# Altium project Super_Iron.PrjPcb
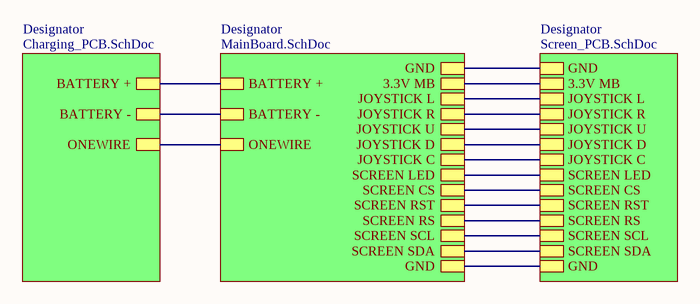
[diagram p0: main.SchDoc]
4 sheets, 165 parts. Net scope: hierarchical (ports join the sheet entries above them; power ports are global).
Sheets:
  main.SchDoc
    Designator = Charging_PCB.SchDoc
    Designator = MainBoard.SchDoc
    Designator = Screen_PCB.SchDoc

## Sheet main.SchDoc
size A2; Organization: Altium Limited; Address1: L3, 12a Rodborough Rd; Address2: Frenchs Forest; Address3: NSW; Address4: Australia 2086

### Sub-sheets
Designator = Charging_PCB.SchDoc: BATTERY +, BATTERY -, ONEWIRE
Designator = MainBoard.SchDoc: BATTERY +, BATTERY -, ONEWIRE, GND, 3.3V MB, SCREEN CS, JOYSTICK D, SCREEN SCL, JOYSTICK U, SCREEN SDA, SCREEN RS, JOYSTICK R, JOYSTICK L, JOYSTICK C, SCREEN RST, SCREEN LED, GND
Designator = Screen_PCB.SchDoc: SCREEN LED, GND, GND, SCREEN SDA, JOYSTICK C, SCREEN CS, SCREEN SCL, JOYSTICK U, SCREEN RS, 3.3V MB, SCREEN RST, JOYSTICK R, JOYSTICK D, JOYSTICK L

### Nets
GND: sheet Designator/BATTERY -, sheet Designator/BATTERY -, sheet Designator/GND, sheet Designator/GND, sheet Designator/GND, sheet Designator/GND
3.3V MB: sheet Designator/3.3V MB, sheet Designator/3.3V MB
BATTERY +: sheet Designator/BATTERY +, sheet Designator/BATTERY +
JOYSTICK D: sheet Designator/JOYSTICK D, sheet Designator/JOYSTICK D
JOYSTICK L: sheet Designator/JOYSTICK L, sheet Designator/JOYSTICK L
JOYSTICK R: sheet Designator/JOYSTICK R, sheet Designator/JOYSTICK R
JOYSTICK U: sheet Designator/JOYSTICK U, sheet Designator/JOYSTICK U
JOYSTICK С: sheet Designator/JOYSTICK C, sheet Designator/JOYSTICK C
ONEWIRE: sheet Designator/ONEWIRE, sheet Designator/ONEWIRE
SCREEN CS: sheet Designator/SCREEN CS, sheet Designator/SCREEN CS
SCREEN RS: sheet Designator/SCREEN RS, sheet Designator/SCREEN RS
SCREEN RST: sheet Designator/SCREEN RST, sheet Designator/SCREEN RST
SCREEN SCL: sheet Designator/SCREEN SCL, sheet Designator/SCREEN SCL
SCREEN SDA: sheet Designator/SCREEN SDA, sheet Designator/SCREEN SDA
NetR28_2: sheet Designator/SCREEN LED, sheet Designator/SCREEN LED

### Notes on the sheet
- Title
- Size:
- Date:
- File:
- A2
- Number:
- Time:
- Revision:
- Sheet
- of

## Sheet Charging_PCB.SchDoc
size A2; Organization: Altium Limited; Address1: L3, 12a Rodborough Rd; Address2: Frenchs Forest; Address3: NSW; Address4: Australia 2086
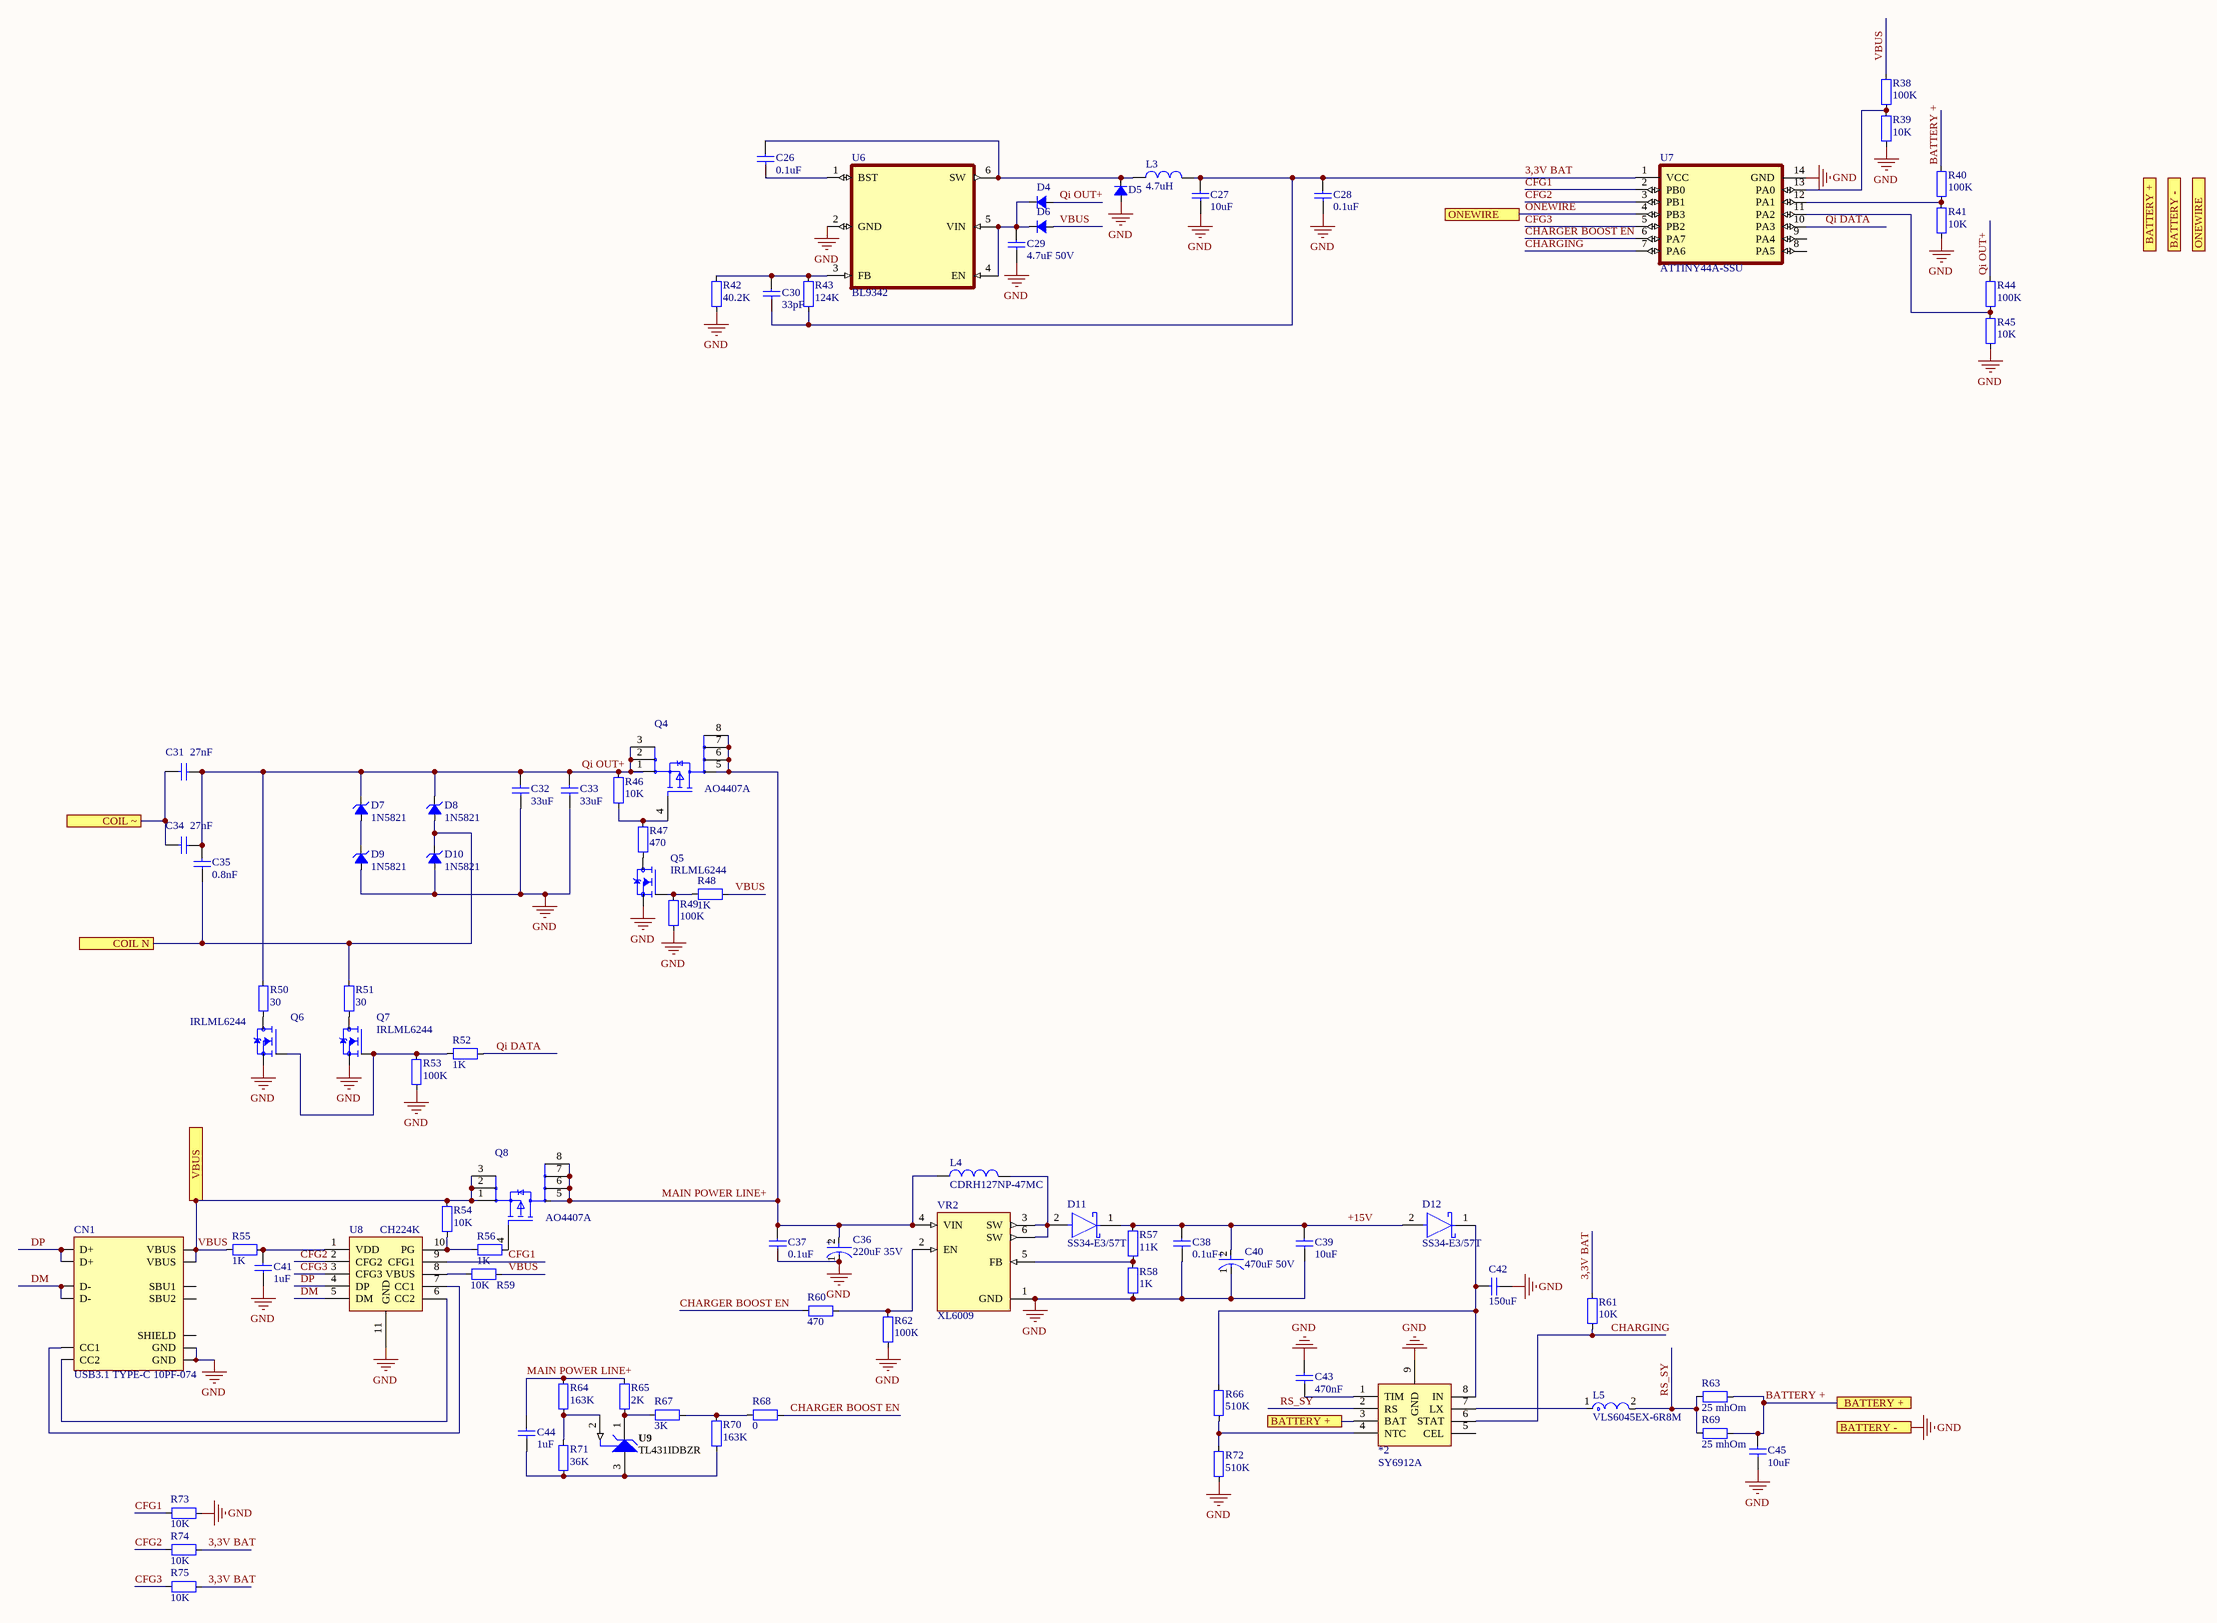
[diagram p1: Charging_PCB.SchDoc]

### Parts
*2  SY6912A  [SO8]
C26  0.1uF  [C0805]
C27  10uF  [C0805]
C28  0.1uF  [C0805]
C29  4.7uF 50V  [C0805]
C30  33pF  [C0805]
C31  27nF  [1206]
C32  33uF  [1206]
C33  33uF  [1206]
C34  27nF  [1206]
C35  0.8nF  [1206]
C36  220uF 35V  [FP-RAD-TH-D_8_0_5-L_15_1-MFG]
C37  0.1uF  [1206]
C38  0.1uF  [1206]
C39  10uF  [CAPC1005X04L]
C40  470uF 50V  [FP-RAD-TH-D_10_0_5-L_20_2-MFG]
C41  1uF  [1206]
C42  150uF  [CAPC1005X04L]
C43  470nF  [C0805]
C44  1uF  [1206]
C45  10uF  [CAPC1005X04L]
CN1  USB3.1 TYPE-C 10PF-074  [USB3.1 TYPE-C 10PF-074]
D4  (no value)  [SOD-123]
D5  (no value)  [SOD-123]
D6  (no value)  [SOD-123]
D7  1N5821  [DO201-vertical]
D8  1N5821  [DO201-vertical]
D9  1N5821  [DO201-vertical]
D10  1N5821  [DO201-vertical]
D11  SS34-E3/57T  [FP-95402-MFG]
D12  SS34-E3/57T  [FP-95402-MFG]
L3  4.7uH  [CDRH3D16NP]
L4  CDRH127NP-47MC  [SUMI-CDRH127_V]
L5  VLS6045EX-6R8M  [FP-VLS6045EX-100M-MFG]
Q4  AO4407A  [SOP-8_2-5R1S-IPC_B]
Q5  IRLML6244  [SOT-23]
Q6  IRLML6244  [SOT-23]
Q7  IRLML6244  [SOT-23]
Q8  AO4407A  [SOP-8_2-5R1S-IPC_B]
R38  100K  [C0805]
R39  10K  [C0805]
R40  100K  [C0805]
R41  10K  [C0805]
R42  40.2K  [C0805]
R43  124K  [C0805]
R44  100K  [C0805]
R45  10K  [C0805]
R46  10K  [C0805]
R47  470  [C0805]
R48  1K  [C0805]
R49  100K  [C0805]
R50  30  [1206]
R51  30  [1206]
R52  1K  [C0805]
R53  100K  [C0805]
R54  10K  [C0805]
R55  1K  [C0805]
R56  1K  [C0805]
R57  11K  [C0805]
R58  1K  [C0805]
R59  10K  [C0805]
R60  470  [C0805]
R61  10K  [C0805]
R62  100К  [C0805]
R63  25 mhOm  [1206]
R64  163K  [C0805]
R65  2K  [C0805]
R66  510K  [C0805]
R67  3K  [C0805]
R68  0  [C0805]
R69  25 mhOm  [1206]
R70  163K  [C0805]
R71  36K  [C0805]
R72  510K  [C0805]
R73  10K  [C0805]
R74  10K  [C0805]
R75  10K  [C0805]
U6  BL9342  [SOT50P160X60-6N]
U7  ATTINY44A-SSU  [SOIC127P600X175-14N]
U8  CH224K  [ESSOP10]
U9  TL431IDBZR  [SOT95P237X112-3N]
VR2  XL6009  [DPAK170P1435X465-6N]

### Ports
BATTERY +, BATTERY -, COIL N, COIL ~, ONEWIRE, VBUS

### Nets
GND: *2.9(GND) C27.1 C28.1 C29.1 C32.2 C33.2 C36.1(C) C37.1 C38.1 C39.1 C40.1(C) C41.1 C42.2 C43.2 C45.1 CN1.1(GND) CN1.12(GND) D5.1(A) D9.1(K) D10.1(K) Q5.2(S) Q6.2(S) Q7.2(S) R39.1 R41.1 R42.1 R45.1 R49.1 R53.1 R58.2 R62.2 R72.2 R73.2 U6.2(GND) U7.14(GND) U8.11(GND) VR2.1(GND) ; port BATTERY -
3,3V BAT: C27.2 C28.2 C30.1 L3.2 R43.1 R61.2 R74.2 R75.2 U7.1(VCC)
+15V: C38.2 C39.2 C40.2(A) D11.1(C) D12.2(A) R57.1
BATTERY +: *2.3(BAT) C45.2 R40.2 R63.2 R69.2 ; port BATTERY +
CFG1: R73.1 U7.2(PB0) U8.9(CFG1)
CFG2: R74.1 U7.3(PB1) U8.2(CFG2)
CFG3: R75.1 U7.5(PB2) U8.3(CFG3)
CHARGER BOOST EN: R60.2 R68.2 U7.6(PA7)
CHARGING: *2.6(STAT) R61.1 U7.7(PA6)
DM: CN1.6(D-) CN1.9(D-) U8.5(DM)
DP: CN1.4(D+) CN1.7(D+) U8.4(DP)
MAIN POWER LINE+: C36.2(A) C37.2 C44.2 L4.1 Q4.5(Drain) Q4.6(Drain) Q4.7(Drain) Q4.8(Drain) Q8.5(Drain) Q8.6(Drain) Q8.7(Drain) Q8.8(Drain) R64.2 R65.2 VR2.4(VIN)
ONEWIRE: U7.4(PB3) ; port ONEWIRE
Qi DATA: R52.2 U7.10(PA3)
Qi OUT+: C31.1 C32.1 C33.1 C34.1 C35.1 D4.1(A) D7.2(A) D8.2(A) Q4.1(Source) Q4.2(Source) Q4.3(Source) R44.2 R46.2 R50.2
RS_SY: *2.2(RS) L5.2 R63.1 R69.1
VBUS: CN1.3(VBUS) CN1.10(VBUS) D6.1(A) Q8.1(Source) Q8.2(Source) Q8.3(Source) R38.2 R48.2 R54.2 R55.1 R59.2 ; port VBUS
Net*2_1: *2.1(TIM) C43.1
Net*2_4: *2.4(NTC) R66.2 R72.1
Net*2_7: *2.7(LX) L5.1
Net*2_8: *2.8(IN) C42.1 D12.1(C) R66.1
NetC26_1: C26.1 U6.1(BST)
NetC26_2: C26.2 D5.2(K) L3.1 U6.6(SW)
NetC29_2: C29.2 D4.2(K) D6.2(K) U6.4(EN) U6.5(VIN)
NetC30_2: C30.2 R42.2 R43.2 U6.3(FB)
NetC31_2: C31.2 C34.2 ; port COIL ~
NetC35_2: C35.2 D8.1(K) D10.2(A) R51.2 ; port COIL N
NetC41_2: C41.2 R55.2 U8.1(VDD)
NetC44_1: C44.1 R70.1 R71.1 U9.3(ANODE)
NetCN1_2: CN1.2(CC1) U8.7(CC1)
NetCN1_8: CN1.8(CC2) U8.6(CC2)
NetD7_1: D7.1(K) D9.2(A)
NetD11_2: D11.2(A) L4.2 VR2.3(SW) VR2.6(SW)
NetQ4_4: Q4.4(Gate) R46.1 R47.2
NetQ5_1: Q5.1(G) R48.1 R49.2
NetQ5_3: Q5.3(D) R47.1
NetQ6_1: Q6.1(G) Q7.1(G) R52.1 R53.2
NetQ6_3: Q6.3(D) R50.1
NetQ7_3: Q7.3(D) R51.1
NetQ8_4: Q8.4(Gate) R56.2
NetR38_1: R38.1 R39.2 U7.13(PA0)
NetR40_1: R40.1 R41.2 U7.12(PA1)
NetR44_1: R44.1 R45.2 U7.11(PA2)
NetR54_1: R54.1 R56.1 U8.10(PG)
NetR57_2: R57.2 R58.1 VR2.5(FB)
NetR59_1: R59.1 U8.8(VBUS)
NetR60_1: R60.1 R62.1 VR2.2(EN)
NetR64_1: R64.1 R71.2 U9.2(REF)
NetR65_1: R65.1 R67.1 U9.1(CATHODE)
NetR67_2: R67.2 R68.1 R70.2

Not connected (* = marked no-connect by the designer): *2 5(CEL); CN1 5(SBU2) 11(SBU1) MH(SHIELD); U7 8(PA5) 9(PA4)

### Notes on the sheet
- Title
- Size:
- Date:
- File:
- A2
- Number:
- Time:
- Revision:
- Sheet
- of
- (in symbol CAP 10x20) +
- (in symbol CMP-05427-000678-1) +

### Library data of the parts
C26-C35 C37-C39 C41-C45 = CAP
  C26 C28 C37 C38: Value: 0.1uF
  C27 C39 C45: Value: 10uF
  C29: Value: 4.7uF 50V
  C30: Value: 33pF
  C31 C34: Value: 27nF
  C32 C33: Value: 33uF
  C35: Value: 0.8nF
  C41 C44: Value: 1uF
  C42: Value: 150uF
  C43: Value: 470nF
C36 = CMP-05427-000678-1: Aluminum Electrolytic Capacitors (Radial Lead Type) 220uF ±20% 35V; Ripple Current: 1.24A; Impedance: 41mR; Lead Length: 17mm; Life (Hours): 3000Hour; Lead Diameter: 0.6mm; Dielectric Material: Aluminium; Dissipation Factor: 0.12%; Package Quantity: 200; Tolerance: 20%; Series: FM; Voltage Rating: 35V; Lead Pitch: 3.5mm; Radiation Hardening: No; Construction: RADIAL; RoHS Compliant: Yes; REACH SVHC: Yes; Lead Free: Lead Free; Height - Seated (Max): 0.65inch; Length: 15mm; Diameter: 8mm; Mount: Through Hole; Number of Pins: 2; Height: 15mm; Voltage: 35V; Case/Package: Radial; Packaging: Bulk; Min Operating Temperature: -40°C; Voltage Rating (DC): 35V; ESR (Equivalent Series Resistance): 41mR; Capacitance: 220uF; Max Operating Temperature: 105°C; Termination: Radial
C40 = CAP 10x20: Aluminum Electrolytic Capacitors (Radial Lead Type) 10uF ±20% 400V; Lead/Base Style: Straight; Lead Diameter: 0.6mm; Dissipation Factor: 0.24%; Ripple Current (AC): 80mA; Life (Hours): 2000Hour; Polarity: Polar; Dielectric Material: Aluminium; Lead Free: Lead Free; Capacitance: 10uF; Tolerance: 20%; Height: 20mm; Number of Pins: 2; Case/Package: Radial; Package Quantity: 200; REACH SVHC: No SVHC; Termination: Radial; Radiation Hardening: No; Diameter: 10mm; RoHS Compliant: Yes; Construction: RADIAL; Max Operating Temperature: 105°C; Voltage Rating: 400V; Mount: Through Hole; Voltage: 400V; Height - Seated (Max): 0.866inch; Lead Pitch: 5mm; Voltage Rating (DC): 400V; Contact Plating: Tin; Length: 20mm; Series: NHG; Min Operating Temperature: -25°C; Packaging: Bulk; Ripple Current: 80mA
CN1 = USB3.1 TYPE-C 10PF-074: XKB Connectivity USB-C Connector
D4-D6 = Diode_SOD123: Schottky diode SOD123; Note: Schottky diode  SOD123
D7-D10 = Diode_Shottki_DO201V: DO201; Manufacturer Part Number: China; Note: 1N5821; Value: 1N5821
D11 D12 = SS34: DIODE SCHOTTKY 40V 3A DO214AB; Manufacturer: Vishay; Max Junction Temp: +150°C; Peak Reverse Current: 0.5mA; Max Surge Forward Current: 100A; Standoff Height: 0mm; ComponentLink2Description: Datasheet; Device Class L3: Schottky Diodes; Height: 2.62mm; Max Repetitive Reverse Voltage: 40V; Lead Free: Yes; Package: 95402; Temperature Range High: +150°C; ComponentLink2URL: http://www.vishay.com/docs/88751/ss32.pdf; Temperature: -55°C to +150°C; Footprint Url: http://www.vishay.com/docs/95402/smc.pdf; Automotive: No; Forward Current: 3A; Category: Diode; Manufacturer Part Number: SS34-E3/57T; RoHS: TRUE; Device Class L2: Diodes; Mouser Description: Schottky Diodes & Rectifiers 3.0 Amp 40 Volt; Octopart: https://octopart.com/ss34-e3%2F57t-vishay-39552907; Temperature Range Low: -55°C; Device Class L1: Discrete Semiconductors; Digikey Description: DIODE SCHOTTKY 40V 3A DO214AB
L3 = CDRH3D16NP: 4,7µH Shielded Inductor 900mA 140mOhm Max Nonstandard; Manufacturer: Sumida; Manufacturer Part Number: CDRH3D16NP-100NC; Note: 4.7µH Shielded Inductor 550mA 140mOhm; Value: 4.7uH
L4 = CMP-2000-06084-1: Power Inductor, 10 uH, +/- 20%, -40 to 100 degC, 2-Pin SMD, RoHS, Tape and Reel; Manufacturer: Sumida; Catalog Drawings: CDRH127SeriesFrontCDRH127SeriesSideCDRH127SeriesBottom; Product Training Modules: PowerInductorBasics; Shielding: Shielded; Online Catalog: CDRHSeries; DC Resistance (DCR): 21.6mOhmMax; Other Names: 308-1457-1; Frequency - Test: 1kHz; Mounting Type: SurfaceMount; Datasheet Version: 01/2014; Package Description: 2-Pin Surface Mount Device, Body 12 x 12 mm; Frequency - Self Resonant: -; Package Reference: CDRH127; Category: Inductors,Coils,Chokes; Material - Core: -; Q @ Freq: -; Type: -; Family: FixedInductors; Ratings: -; Series: CDRH127; Manufacturer URL: http://www.sumida.com/; Operating Temperature: -40°C~100°C; Height - Seated (Max): 0.315"(8.00mm); Standard Package: 1; Size / Dimension: 0.472"Lx0.472"W(12.00mmx12.00mm); Current - Saturation: -; Datasheet URL: http://products.sumida.com/products/pdf/CDRH127.pdf; Package / Case: Nonstandard; Tolerance: ±20%; Mounting Technology: SurfaceMount; Packaging: CutTape(CT)
L5 = VLS6045EX: FIXED IND  SMD; Shielding: Shielded; Test Frequency: 100kHz; Core Material: Ferrite; Inductance Tolerance: 20%; DC Resistance (DCR): 61mR; REACH SVHC: No SVHC; Min Operating Temperature: -40°C; RoHS Compliant: Yes; Length: 0.236inch; Lead Free: Lead Free; Packaging: Cut Tape; Width: 0.236inch; Case/Package: Nonstandard; Resistor Type: Wirewound; Height - Seated (Max): 0.177inch; Mount: Surface Mount; Max Operating Temperature: 105°C; Tolerance: 20%
Q4 Q8 = MOSFET P-CH 30V 9A 8SOP: Rise Time: 8ns; Input Capacitance: 1.65nF; Fall Time: 42ns; Rds On Max: 22mR; Gate to Source Voltage (Vgs): 20V; Number of Pins: 8; Packaging: Tape and Reel; Mount: Surface Mount; Radiation Hardening: No; Continuous Drain Current (ID): 9A; Series: -; Package Quantity: 2500; Drain to Source Voltage (Vdss): 30V; Case/Package: SOIC; Max Operating Temperature: 150°C; Min Operating Temperature: -55°C
Q5-Q7 = IRLML6244: MOSFET P-CH 30V 3.6A SOT-23-3; MF: {'manufacturer': u'Infineon Technologies'}; MP: IRLML9301TRPBF; Package: None; Price: None; Value: *; Availability: Unavailable
R38-R75 = RES SMD UNI: Resistor SMD; Category: Resistors
  R38 R40 R44 R49 R53: Value: 100K
  R39 R41 R45 R46 R54 R59 R61 R73-R75: Value: 10K
  R42: Value: 40.2K
  R43: Value: 124K
  R47 R60: Value: 470
  R48 R52 R55 R56 R58: Value: 1K
  R50 R51: Value: 30
  R57: Value: 11K
  R62: Value: 100К
  R63 R69: Value: 25 mhOm
  R64 R70: Value: 163K
  R65: Value: 2K
  R66 R72: Value: 510K
  R67: Value: 3K
  R68: Value: 0
  R71: Value: 36K
U6 = BL9342: MF: {'manufacturer': u'Texas Instruments'}; Package: None; MP: BL9342; Value: *; Price: None; Availability: Unavailable
U7 = ATTINY44A-SSU: MF: {'manufacturer': u'Microchip'}; Package: None; Value: *; Price: None; MP: ATTINY44A-SSU; Availability: Unavailable
U8 = CH224K: IC PD QC USB driver; Manufacturer: ST; Manufacturer Part Number: ST3485EBDR; Note: IC TXRX 3.3V RS485/422 8 SOIC
U9 = TL431IDBZR: Adjustable Precision Shunt Regulator, 34 ppm / degC, 100 mA, -40 to 85 degC, 3-pin SOT-23 (DBZ), Green (RoHS & no Sb/Br); Manufacturer: Texas Instruments; VO Adj(Max)(V): 36; VO Adj(Min)(V): 2.495; Temp Coeff(Max)(ppm/ degree C): 92; Iout/Iz(Max)(mA): 100; Temp Coeff(Typ)(ppm/ degree C): 34; Rating: Military; Initial Accuracy @ 25/deg C(%): 2; SubFamily: Shunt Voltage Reference; Min Iz for Regulation(uA): 600; Eco-Plan: Green (RoHS & no Sb/Br); ComponentLink3URL: http://www.ti.com/litv/pdf/mpds108a; ComponentLink3Description: Package Specification; ComponentLink1Description: Manufacturer URL; Code_JEDEC: TO-236; PartNumber: TL431IDBZR; PackageReference: DBZ0003A; ComponentLink1URL: http://www.ti.com/; ComponentLink2URL: http://www.ti.com/general/docs/lit/getliterature.tsp?genericPartNumber=TL431&fileType=pdf; DatasheetVersion: SLVS543M; ComponentLink2Description: Datasheet; PackageVersion: 4203227/B; Mounting Technology: Surface Mount; PackageDescription: 3-Pin Plastic Small Outline, Body 2.92 x 1.3 mm, Pitch 0.95 mm
VR2 = XL6009: The XL6009 regulator is a wide input range, current mode, DC/DC converter which is capable of generating either positive or negative output voltages.; MF: {'manufacturer': u'XLSEMI'}; Price: None; Package: None; Availability: Unavailable; Value: *; MP: XL6009

## Sheet MainBoard.SchDoc
size A2; Organization: Altium Limited; Address1: L3, 12a Rodborough Rd; Address2: Frenchs Forest; Address3: NSW; Address4: Australia 2086
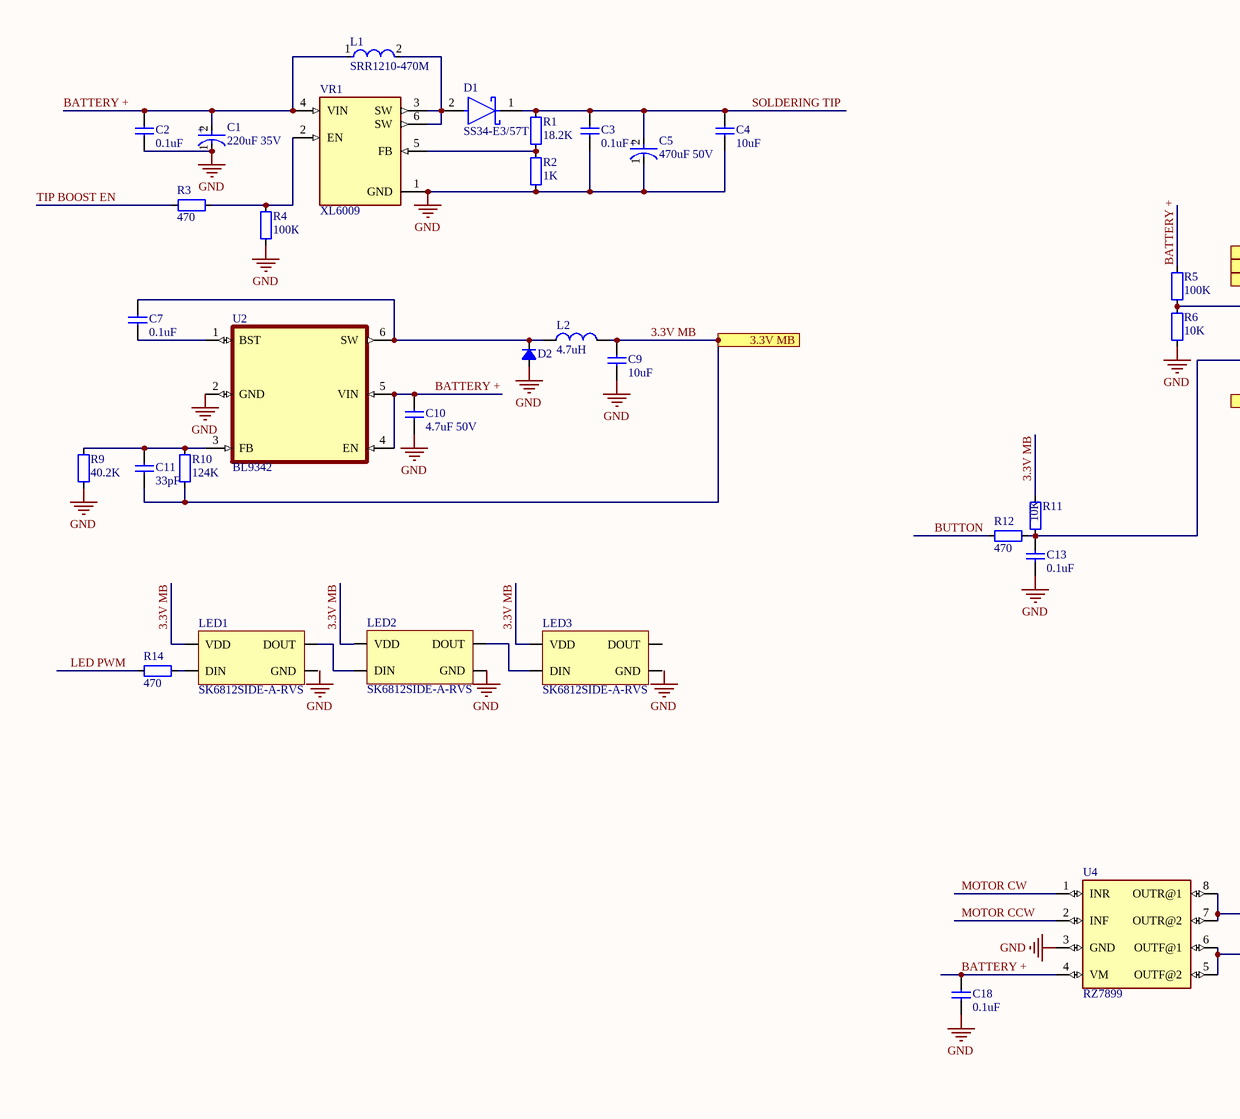
[diagram p2: MainBoard.SchDoc, left]
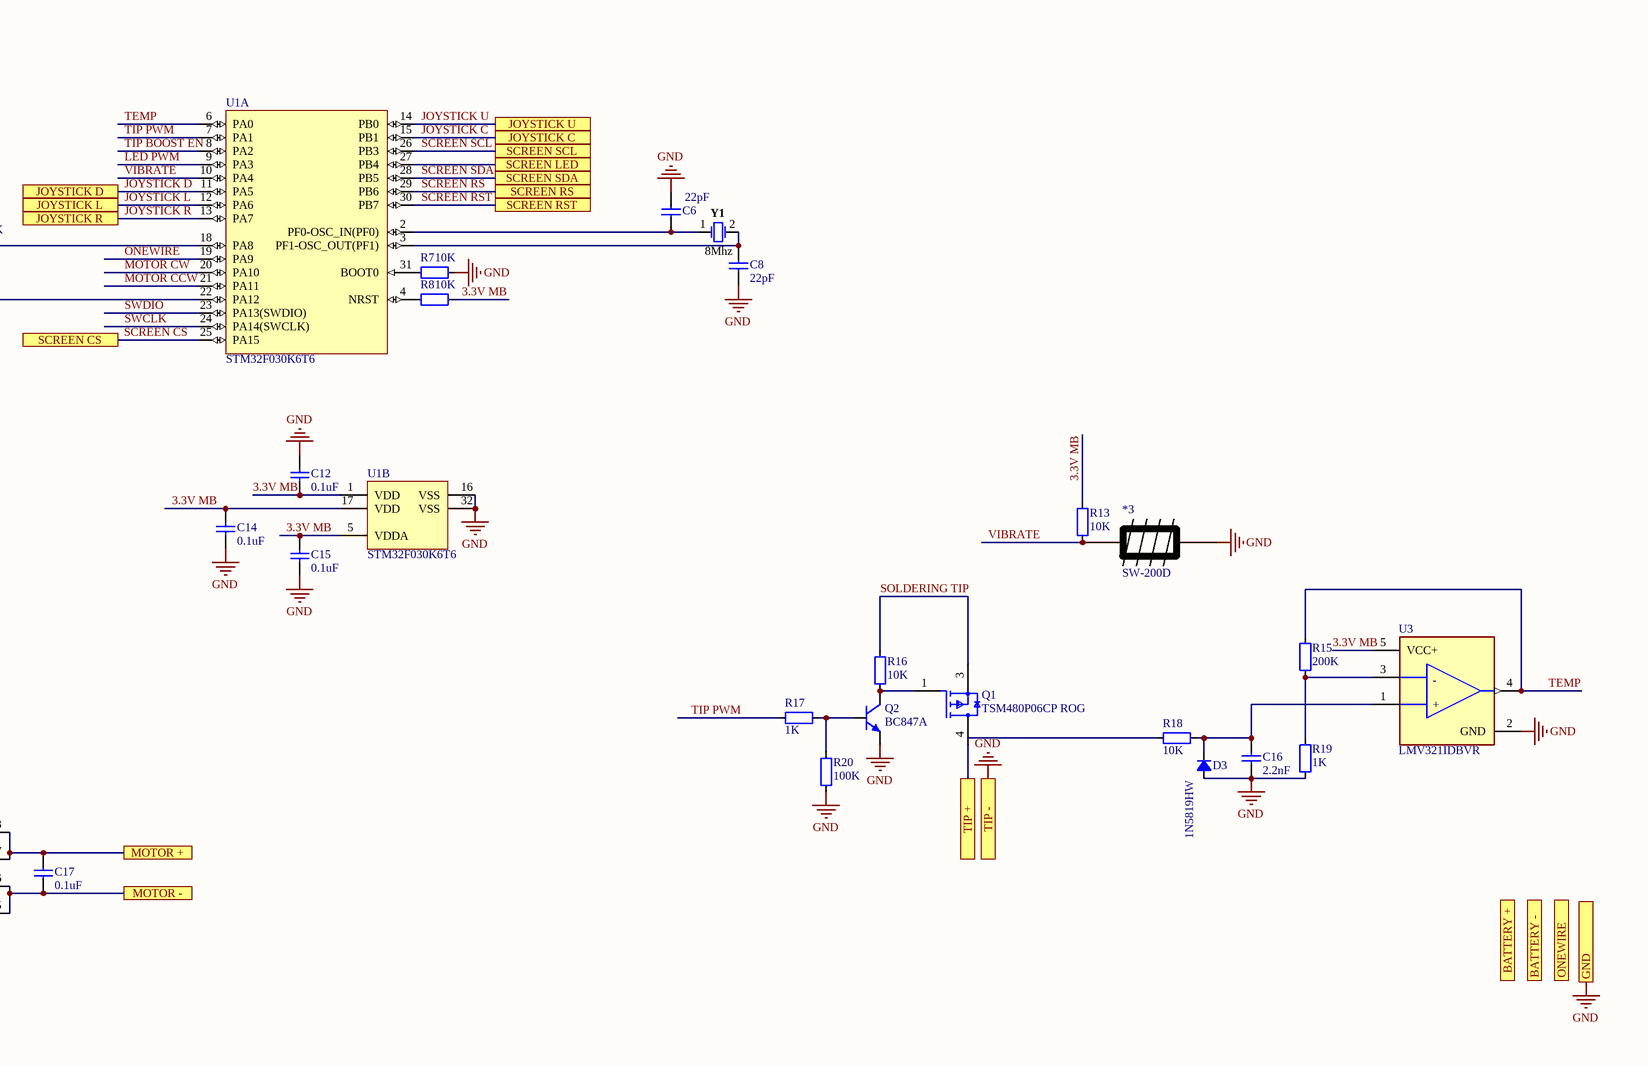
[diagram p3: MainBoard.SchDoc, right]

### Parts
*3  SW-200D  [SW-200D]
C1  220uF 35V  [FP-RAD-TH-D_8_0_5-L_15_1-MFG]
C2  0.1uF  [1206]
C3  0.1uF  [1206]
C4  10uF  [CAPC1005X04L]
C5  470uF 50V  [FP-RAD-TH-D_10_0_5-L_20_2-MFG]
C6  22pF  [R0603]
C7  0.1uF  [C0805]
C8  22pF  [R0603]
C9  10uF  [C0805]
C10  4.7uF 50V  [C0805]
C11  33pF  [C0805]
C12  0.1uF  [1206]
C13  0.1uF  [R0603]
C14  0.1uF  [1206]
C15  0.1uF  [1206]
C16  2.2nF  [C0805]
C17  0.1uF  [1206]
C18  0.1uF  [1206]
D1  SS34-E3/57T  [FP-95402-MFG]
D2  (no value)  [SOD-123]
D3  1N5819HW  [SOD-123]
L1  SRR1210-470M  [FP-SRR1210-MFG]
L2  4.7uH  [CDRH3D16NP]
LED1  SK6812SIDE-A-RVS  [SK6812SIDE-A-RVS]
LED2  SK6812SIDE-A-RVS  [SK6812SIDE-A-RVS]
LED3  SK6812SIDE-A-RVS  [SK6812SIDE-A-RVS]
Q1  TSM480P06CP ROG  [FP-TO-252-MFG]
Q2  BC847A  [SOT95P237X112-3N]
R1  18.2K  [C0805]
R2  1K  [C0805]
R3  470  [C0805]
R4  100К  [C0805]
R5  100K  [C0805]
R6  10K  [C0805]
R7  10K  [C0805]
R8  10K  [C0805]
R9  40.2K  [C0805]
R10  124K  [C0805]
R11  10K  [R0603]
R12  470  [R0603]
R13  10K  [C0805]
R14  470  [C0805]
R15  200K  [C0805]
R16  10K  [C0805]
R17  1K  [C0805]
R18  10K  [C0805]
R19  1K  [C0805]
R20  100K  [C0805]
U1  STM32F030K6T6  [LQFP32_L]  (parts A,B of 2)
U2  BL9342  [SOT50P160X60-6N]
U3  LMV321IDBVR  [FP-DBV0005A-MFG]
U4  RZ7899  [SOP-8_2-5R1S-IPC_B]
VR1  XL6009  [DPAK170P1435X465-6N]
Y1  8Mhz  [FOX-HC49SDLF_V]

### Ports
3.3V MB, BATTERY +, BATTERY -, GND, JOYSTICK C, JOYSTICK D, JOYSTICK L, JOYSTICK R, JOYSTICK U, MOTOR +, MOTOR -, ONEWIRE, SCREEN CS, SCREEN LED, SCREEN RS, SCREEN RST, SCREEN SCL, SCREEN SDA, TIP +, TIP -

### Nets
GND: *3.2 C1.1(C) C2.1 C3.1 C4.1 C5.1(C) C6.1 C8.1 C9.1 C10.1 C12.2 C13.1 C14.2 C15.2 C16.1 C18.2 D2.1(A) D3.1(A) LED2.4(GND) Q2.2(E) R2.2 R4.2 R6.1 R7.1 R9.1 R19.2 R20.1 U1.16(VSS) U1.32(VSS) U2.2(GND) U3.2(GND) U4.3(GND) VR1.1(GND) ; port TIP -, port BATTERY -, port GND
3.3V MB: C9.2 C11.1 C12.1 C14.1 C15.1 L2.2 LED1.2(VDD) LED2.2(VDD) LED3.2(VDD) R8.1 R10.1 R11.1 R13.2 U1.1(VDD) U1.5(VDDA) U1.17(VDD) U3.5(VCC+) ; port 3.3V MB
BATTERY +: C1.2(A) C2.2 C10.2 C18.1 L1.1 R5.2 U2.4(EN) U2.5(VIN) U4.4(VM) VR1.4(VIN)
BUTTON: R12.1
JOYSTICK D: U1.11(PA5) ; port JOYSTICK D
JOYSTICK L: U1.12(PA6) ; port JOYSTICK L
JOYSTICK R: U1.13(PA7) ; port JOYSTICK R
JOYSTICK U: U1.14(PB0) ; port JOYSTICK U
JOYSTICK С: U1.15(PB1) ; port JOYSTICK C
LED PWM: R14.2 U1.9(PA3)
MOTOR CCW: U1.21(PA11) U4.2(INF)
MOTOR CW: U1.20(PA10) U4.1(INR)
ONEWIRE: U1.19(PA9)
SCREEN CS: U1.25(PA15) ; port SCREEN CS
SCREEN RS: U1.29(PB6) ; port SCREEN RS
SCREEN RST: U1.30(PB7) ; port SCREEN RST
SCREEN SCL: U1.26(PB3) ; port SCREEN SCL
SCREEN SDA: U1.28(PB5) ; port SCREEN SDA
SOLDERING TIP: C3.2 C4.2 C5.2(A) D1.1(C) Q1.3(Source) R1.1 R16.2
SWCLK: U1.24(PA14(SWCLK))
SWDIO: U1.23(PA13(SWDIO))
TEMP: R15.1 U1.6(PA0) U3.4(OUT)
TIP BOOST EN: R3.2 U1.8(PA2)
TIP PWM: R17.2 U1.7(PA1)
VIBRATE: *3.1 R13.1 U1.10(PA4)
NetC6_2: C6.2 U1.2(PF0-OSC_IN(PF0)) Y1.1
NetC7_1: C7.1 U2.1(BST)
NetC7_2: C7.2 D2.2(K) L2.1 U2.6(SW)
NetC8_2: C8.2 U1.3(PF1-OSC_OUT(PF1)) Y1.2
NetC11_2: C11.2 R9.2 R10.2 U2.3(FB)
NetC13_2: C13.2 R11.2 R12.2 U1.22(PA12)
NetC16_2: C16.2 D3.2(K) R18.2 U3.1(1IN+)
NetC17_1: C17.1 U4.7(OUTR@2) U4.8(OUTR@1) ; port MOTOR +
NetC17_2: C17.2 U4.5(OUTF@2) U4.6(OUTF@1) ; port MOTOR -
NetD1_2: D1.2(A) L1.2 VR1.3(SW) VR1.6(SW)
NetLED1_1: LED1.1(DIN) R14.1
NetLED1_3: LED1.3(DOUT) LED2.1(DIN)
NetLED2_3: LED2.3(DOUT) LED3.1(DIN)
NetQ1_1: Q1.1(Gate) Q2.3(C) R16.1
NetQ1_4: Q1.4(Drain) ; port TIP +
NetQ2_1: Q2.1(B) R17.1 R20.2
NetR1_2: R1.2 R2.1 VR1.5(FB)
NetR3_1: R3.1 R4.1 VR1.2(EN)
NetR5_1: R5.1 R6.2 U1.18(PA8)
NetR7_2: R7.2 U1.31(BOOT0)
NetR8_2: R8.2 U1.4(NRST)
NetR15_2: R15.2 R19.1 U3.3(1IN-)
NetR28_2: U1.27(PB4) ; port SCREEN LED

Not connected (* = marked no-connect by the designer): LED1 4(GND); LED3 3(DOUT) 4(GND); R18 1

### Notes on the sheet
- Labels drawn without touching a wire or pin: GND
- Title
- Size:
- Date:
- File:
- A2
- Number:
- Time:
- Revision:
- Sheet
- of
- (in symbol CAP 10x20) +
- (in symbol CMP-05427-000678-1) +
- (in symbol LMV321) -; +

### Library data of the parts
C1 = CMP-05427-000678-1: as C36 on sheet Charging_PCB; Package Quantity: 200; Tolerance: 20%; Series: FM; Voltage Rating: 35V; Lead Pitch: 3.5mm; Radiation Hardening: No; Construction: RADIAL; RoHS Compliant: Yes; REACH SVHC: Yes; Lead Free: Lead Free; Height - Seated (Max): 0.65inch; Length: 15mm; Diameter: 8mm; Mount: Through Hole; Number of Pins: 2; Height: 15mm; Voltage: 35V; Case/Package: Radial; Packaging: Bulk; Min Operating Temperature: -40°C; Voltage Rating (DC): 35V; ESR (Equivalent Series Resistance): 41mR; Capacitance: 220uF; Max Operating Temperature: 105°C; Termination: Radial
C2-C4 C6-C18 = CAP
  C2 C3 C7 C12-C15 C17 C18: Value: 0.1uF
  C4 C9: Value: 10uF
  C6 C8: Value: 22pF
  C10: Value: 4.7uF 50V
  C11: Value: 33pF
  C16: Value: 2.2nF
C5 = CAP 10x20: as C40 on sheet Charging_PCB; Lead Free: Lead Free; Capacitance: 10uF; Tolerance: 20%; Height: 20mm; Number of Pins: 2; Case/Package: Radial; Package Quantity: 200; REACH SVHC: No SVHC; Termination: Radial; Radiation Hardening: No; Diameter: 10mm; RoHS Compliant: Yes; Construction: RADIAL; Max Operating Temperature: 105°C; Voltage Rating: 400V; Mount: Through Hole; Voltage: 400V; Height - Seated (Max): 0.866inch; Lead Pitch: 5mm; Voltage Rating (DC): 400V; Contact Plating: Tin; Length: 20mm; Series: NHG; Min Operating Temperature: -25°C; Packaging: Bulk; Ripple Current: 80mA
D1 = SS34: as D11 on sheet Charging_PCB; ComponentLink2Description: Datasheet; Device Class L3: Schottky Diodes; Height: 2.62mm; Max Repetitive Reverse Voltage: 40V; Lead Free: Yes; Package: 95402; Temperature Range High: +150°C; ComponentLink2URL: http://www.vishay.com/docs/88751/ss32.pdf; Temperature: -55°C to +150°C; Footprint Url: http://www.vishay.com/docs/95402/smc.pdf; Automotive: No; Forward Current: 3A; Category: Diode; Manufacturer Part Number: SS34-E3/57T; RoHS: TRUE; Device Class L2: Diodes; Mouser Description: Schottky Diodes & Rectifiers 3.0 Amp 40 Volt; Octopart: https://octopart.com/ss34-e3%2F57t-vishay-39552907; Temperature Range Low: -55°C; Device Class L1: Discrete Semiconductors; Digikey Description: DIODE SCHOTTKY 40V 3A DO214AB
D2 = Diode_SOD123: Schottky diode SOD123; Note: Schottky diode  SOD123
D3 = Diode_SOD123: Schottky diode SOD123 1N5819HW; Note: Schottky diode  SOD123
L1 = SRR1210: FIXED IND  102 MOHM SMD; Manufacturer: Bourns; Manufacturer Part Number: SRR1210-680M; Inductance: 68uH; Rms Current: 3A; Shielding: true; Q Factor: 12; Value: 68uH; Series Resistance: 102mΩ; Saturation Current: 2.7A; Tolerance: 20%; Core Material: Ferrite; Self Resonant Frequency: 3.8MHz; Test Frequency: 2.52MHz; ComponentLink2Description: Datasheet; Device Class L3: Fixed Inductors; Lead Free: Yes; Composition: Wirewound; Temperature: -40°C to +125°C; Automotive: No; RoHS: TRUE; Category: Ind; Device Class L2: Inductors; Height: 10mm; Temperature Range Low: -40°C; Package: SRR1210; Device Class L1: Passive Components; Temperature Range High: +125°C; Mouser Description: Fixed Inductors 68uH 20% SMD 1210; ComponentLink2URL: https://www.bourns.com/docs/Product-Datasheets/SRR1210.pdf; Digikey Description: FIXED IND 68UH 3A 102 MOHM SMD; Octopart: https://octopart.com/srr1210-680m-bourns-10487145
L2 = CDRH3D16NP: as L3 on sheet Charging_PCB; Value: 4.7uH
LED1-LED3 = SK6812SIDE-A-RVS: 2mA -40℃~+85℃ RGB SMD,2x4mm Light Emitting Diodes (LED) ROHS
Q1 = TSM480P06CP ROG: MOSFET P-CHANNEL 60V 20A TO252; Rds On Max: 48mR; Max Power Dissipation: 66W; Input Capacitance: 1.25nF; Mount: Surface Mount; Case/Package: TO-252-3; Min Operating Temperature: -50°C; Continuous Drain Current (ID): 20A; Drain to Source Voltage (Vdss): 60V; Packaging: Cut Tape; RoHS Compliant: Yes; Max Operating Temperature: 150°C
Q2 = BC846A: NPN Silicon AF Transistor, 45 V VCEO, 100 mA IC, SOT23, Reel, Green; Manufacturer: DIOTEC; Note: NPN Silicon AF Transistor, 45 V VCEO, 100 mA IC, SOT23, Reel, Green; ComponentLink3URL: http://www.infineon.com/dgdl/SOT23-Package_Overview.pdf?folderId=db3a30431936bc4b0119532290053c66&fileId=db3a30431936bc4b0119533468123c85; ComponentLink3Description: Package Specification; ComponentLink2URL: http://www.infineon.com/dgdl/bc847series_bc848series_bc849series_bc850series.pdf?folderId=db3a304314dca389011541d30fa21656&fileId=db3a304314dca389011541d4630a1657; ComponentLink1URL: http://www.infineon.com/; ComponentLink2Description: Datasheet; ComponentLink1Description: Manufacturer URL; Manufacturer Part Number: BC847A
R1-R20 = RES SMD UNI: Resistor SMD; Category: Resistors
  R1: Value: 18.2K
  R2 R17 R19: Value: 1K
  R3 R12 R14: Value: 470
  R4: Value: 100К
  R5 R20: Value: 100K
  R6-R8 R11 R13 R16 R18: Value: 10K
  R9: Value: 40.2K
  R10: Value: 124K
  R15: Value: 200K
U1 = CMP-0304-00020-2: ARM Cortex-M0 32-bit MCU, 32 KB Flash, 4 KB Internal RAM, 26 I/Os, 32-pin LQFP, -40 to 85 degC, Tray; I/Os (High Current): 26; FLASH Size (Prog) (kB): 32; Operating Frequency(F) (Processor speed) (MHz): 48; Supply Voltage(Vcc) min (V): 2.4; Internal RAM Size (kB): 4; PackageDescription: 32-Pin Low Profile Quad Flat Package, 7 x 7 mm Body, 0.8 mm Pitch; Core: ARM Cortex-M0; PackageVersion: Rev. 1, 07/2013; ComponentLink1Description: Manufacturer URL; ComponentLink2URL: http://www.st.com/st-web-ui/static/active/en/resource/technical/document/datasheet/DM00088500.pdf; PackageReference: LQFP32; PartNumber: STM32F030K6T6; Mounting Technology: Surface Mount; DatasheetVersion: Rev. 1; ComponentLink2Description: Datasheet; ComponentLink3URL: http://www.st.com/st-web-ui/static/active/en/resource/technical/document/datasheet/DM00088500.pdf; ComponentLink1URL: http://www.st.com/web/en/home.html; ComponentLink3Description: Package Specification; Packing: Tray
U2 = BL9342: as U6 on sheet Charging_PCB; Package: None; MP: BL9342; Value: *; Price: None; Availability: Unavailable
U3 = LMV321: IC OPAMP GP 1 CIRCUIT SOT23-5; Manufacturer: Texas Instruments; Bandwidth: 1MHz; Number Of Channels: 1; Max Junction Temp: +150°C; Input Offset Voltage: 1.7mV; Standoff Height: 0mm; Voltage Gain: 100V/mV; Min Supply Voltage: 2.7V; Input Bias Current: 0.015uA; Nominal Supply Current: 80-130uA; Max Supply Voltage: 5.5V; Ambient Temperature Range Low: -40°C; Device Class L3: Amplifiers - Op Amps; Package: DBV0005A; Temperature: -40°C to +125°C; Automotive: No; Ambient Temperature Range High: +125°C; ComponentLink2Description: Datasheet; Manufacturer Part Number: LMV321IDBVR; Octopart: https://octopart.com/lmv321idbvr-texas+instruments-410381; ComponentLink2URL: http://www.ti.com/lit/ds/symlink/lmv321.pdf; Temperature Range High: +125°C; Device Class L1: Integrated Circuits (ICs); Temperature Range Low: -40°C; Digikey Description: IC OPAMP GP 1 CIRCUIT SOT23-5; RoHS: TRUE; Height: 1.45mm; Mouser Description: Operational Amplifiers - Op Amps Low V R/R; Device Class L2: Linear ICs; Gain Bandwidth: 1MHz; Lead Free: Yes; Category: IC
U4 = RZ7899: MF: {'manufacturer': u'Wuxi'}; Availability: Unavailable; Value: *; Package: None; Price: None; MP: RZ7899
VR1 = XL6009: as VR2 on sheet Charging_PCB; Price: None; Package: None; Availability: Unavailable; Value: *; MP: XL6009
Y1 = CMP-2100-03639-1: Resistance Weld Crystal, 8 MHz, +/- 30 ppm, -20 to 70 degC, 2-Pin SMD, RoHS, Tape and Reel; Manufacturer: FOX Electronics; Series Resistance: 80Ohm; Load Capacitance: 20pF; Tolerance: 50ppm; Frequency Tolerance: 30ppm; Datasheet URL: http://www.foxonline.com/pdfs/hc49sdlf.pdf; Package Reference: HC49SDLF; Height: 4.5mm; Mount: SurfaceMount; Packaging: TapeandReel; Length: 11.7mm; Termination: SMD/SMT; Number of Pins: 2; Depth: 5mm; Frequency: 8MHz; Min Operating Temperature: -20degC; Package Quantity: 1000; RoHSCompliant: True; Lead Free: LeadFree; Width: 5mm; Case/Package: SMD/SMT; Manufacturer URL: http://www.foxonline.com/; Max Operating Temperature: 70degC; REACH SVHC: NoSVHC; Datasheet Version: 42064.0; Package Description: 2-Pin Surface Mount Device, Body 5 x 11.7 mm; Frequency Stability: 50ppm; ESR (Equivalent Series Resistance): 80Ohm; Radiation Hardening: No

## Sheet Screen_PCB.SchDoc
size A2; Organization: Altium Limited; Address1: L3, 12a Rodborough Rd; Address2: Frenchs Forest; Address3: NSW; Address4: Australia 2086
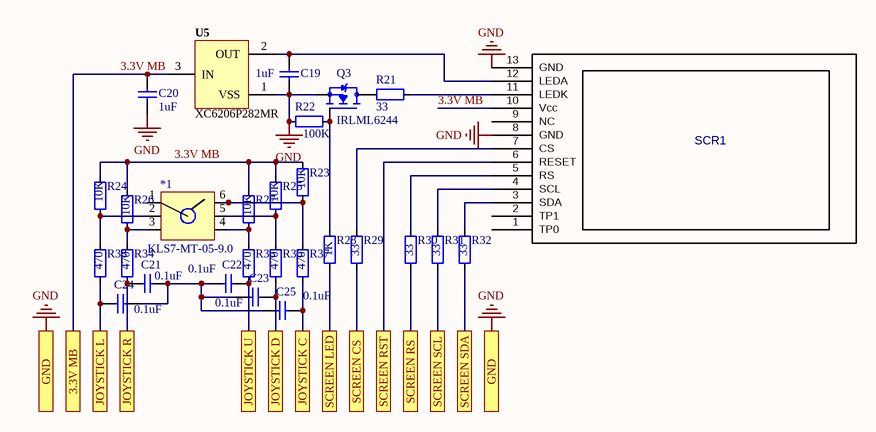
[diagram p4: Screen_PCB.SchDoc]

### Parts
*1  KLS7-MT-05-9.0  [KLS7-MT-05-9.0]
C19  1uF  [C0805]
C20  1uF  [C0805]
C21  0.1uF  [R0603]
C22  0.1uF  [R0603]
C23  0.1uF  [R0603]
C24  0.1uF  [R0603]
C25  0.1uF  [R0603]
Q3  IRLML6244  [SOT-23]
R21  33  [R0603]
R22  100K  [R0603]
R23  10K  [R0603]
R24  10K  [R0603]
R25  10K  [R0603]
R26  10K  [R0603]
R27  10K  [R0603]
R28  1K  [R0603]
R29  33  [R0603]
R30  33  [R0603]
R31  33  [R0603]
R32  33  [R0603]
R33  470  [R0603]
R34  470  [R0603]
R35  470  [R0603]
R36  470  [R0603]
R37  470  [R0603]
SCR1  0.96INCH_TFT  [0.96INCH_TFT]  (value not drawn)
U5  XC6206P282MR  [SOT95P237X112-3N]

### Ports
3.3V MB, GND, JOYSTICK C, JOYSTICK D, JOYSTICK L, JOYSTICK R, JOYSTICK U, SCREEN CS, SCREEN LED, SCREEN RS, SCREEN RST, SCREEN SCL, SCREEN SDA

### Nets
GND: C19.1 C20.1 Q3.2(S) R22.1 SCR1.8(GND) SCR1.13(GND) U5.1(VSS) ; port GND
3.3V MB: C20.2 R23.1 R24.1 R25.1 R26.1 R27.1 SCR1.10(Vcc) U5.3(IN) ; port 3.3V MB
JOYSTICK D: C23.1 R36.2 ; port JOYSTICK D
JOYSTICK L: C24.2 R33.2 ; port JOYSTICK L
JOYSTICK R: C21.2 R34.2 ; port JOYSTICK R
JOYSTICK U: C22.1 R35.2 ; port JOYSTICK U
JOYSTICK С: C25.1 R37.2 ; port JOYSTICK C
SCREEN CS: R29.2 ; port SCREEN CS
SCREEN RS: R30.2 ; port SCREEN RS
SCREEN RST: SCR1.6(RESET) ; port SCREEN RST
SCREEN SCL: R31.2 ; port SCREEN SCL
SCREEN SDA: R32.2 ; port SCREEN SDA
Net*1_2: *1.2 R24.2 R33.1
Net*1_3: *1.3 R26.2 R34.1
Net*1_4: *1.4 R27.2 R35.1
Net*1_5: *1.5 R25.2 R36.1
Net*1_6: *1.6 R23.2 R37.1
NetC19_2: C19.2 SCR1.12(LEDA) U5.2(OUT)
NetC21_1: C21.1 C22.2 C23.2 C24.1 C25.2
NetQ3_1: Q3.1(G) R22.2 R28.1
NetQ3_3: Q3.3(D) R21.2
NetR21_1: R21.1 SCR1.11(LEDK)
NetR28_2: R28.2 ; port SCREEN LED
NetR29_1: R29.1 SCR1.7(CS)
NetR30_1: R30.1 SCR1.5(RS)
NetR31_1: R31.1 SCR1.4(SCL)
NetR32_1: R32.1 SCR1.3(SDA)

Not connected (* = marked no-connect by the designer): *1 1; SCR1 1(TP0) 2(TP1) 9(NC)

### Notes on the sheet
- Title
- Size:
- Date:
- File:
- A2
- Number:
- Time:
- Revision:
- Sheet
- of

### Library data of the parts
C19-C25 = CAP
  C19 C20: Value: 1uF
  C21-C25: Value: 0.1uF
Q3 = IRLML6244: as Q5 on sheet Charging_PCB; Package: None; Price: None; Value: *; Availability: Unavailable
R21-R37 = RES SMD UNI: Resistor SMD; Category: Resistors
  R21 R29-R32: Value: 33
  R22: Value: 100K
  R23-R27: Value: 10K
  R28: Value: 1K
  R33-R37: Value: 470
SCR1 = 0.96INCH_TFT: LH096T-IG01 TFT RGB 0,96" screen; Value: *
U5 = XC6206P282MR: Adjustable Precision Shunt Regulator, 34 ppm / degC, 200 mA, -40 to 85 degC, 3-pin SOT-23 (DBZ), Green (RoHS & no Sb/Br); Manufacturer: UTD; VO Adj(Max)(V): 36; VO Adj(Min)(V): 2.495; Temp Coeff(Max)(ppm/ degree C): 92; Iout/Iz(Max)(mA): 100; Temp Coeff(Typ)(ppm/ degree C): 34; Rating: Military; Initial Accuracy @ 25/deg C(%): 2; SubFamily: Shunt Voltage Reference; Min Iz for Regulation(uA): 600; Eco-Plan: Green (RoHS & no Sb/Br); ComponentLink3URL: http://www.ti.com/litv/pdf/mpds108a; ComponentLink3Description: Package Specification; ComponentLink1Description: Manufacturer URL; Code_JEDEC: TO-236; PartNumber: XC6206P282MR; PackageReference: DBZ0003A; ComponentLink1URL: http://www.ti.com/; ComponentLink2URL: http://www.ti.com/general/docs/lit/getliterature.tsp?genericPartNumber=TL431&fileType=pdf; DatasheetVersion: SLVS543M; ComponentLink2Description: Datasheet; PackageVersion: 4203227/B; Mounting Technology: Surface Mount; PackageDescription: 3-Pin Plastic Small Outline, Body 2.92 x 1.3 mm, Pitch 0.95 mm

## Nets that join several sheets
GND: Charging_PCB (37 pins), MainBoard (33 pins), Screen_PCB (7 pins)
3.3V MB: MainBoard (17 pins), Screen_PCB (8 pins)
JOYSTICK D: MainBoard (U1.11), Screen_PCB (C23.1 R36.2)
JOYSTICK L: MainBoard (U1.12), Screen_PCB (C24.2 R33.2)
JOYSTICK R: MainBoard (U1.13), Screen_PCB (C21.2 R34.2)
JOYSTICK U: MainBoard (U1.14), Screen_PCB (C22.1 R35.2)
JOYSTICK С: MainBoard (U1.15), Screen_PCB (C25.1 R37.2)
NetR28_2: MainBoard (U1.27), Screen_PCB (R28.2)
SCREEN CS: MainBoard (U1.25), Screen_PCB (R29.2)
SCREEN RS: MainBoard (U1.29), Screen_PCB (R30.2)
SCREEN RST: MainBoard (U1.30), Screen_PCB (SCR1.6)
SCREEN SCL: MainBoard (U1.26), Screen_PCB (R31.2)
SCREEN SDA: MainBoard (U1.28), Screen_PCB (R32.2)